# Altium project UZ_D_Encoder.PrjPcb (part 3 of 3)
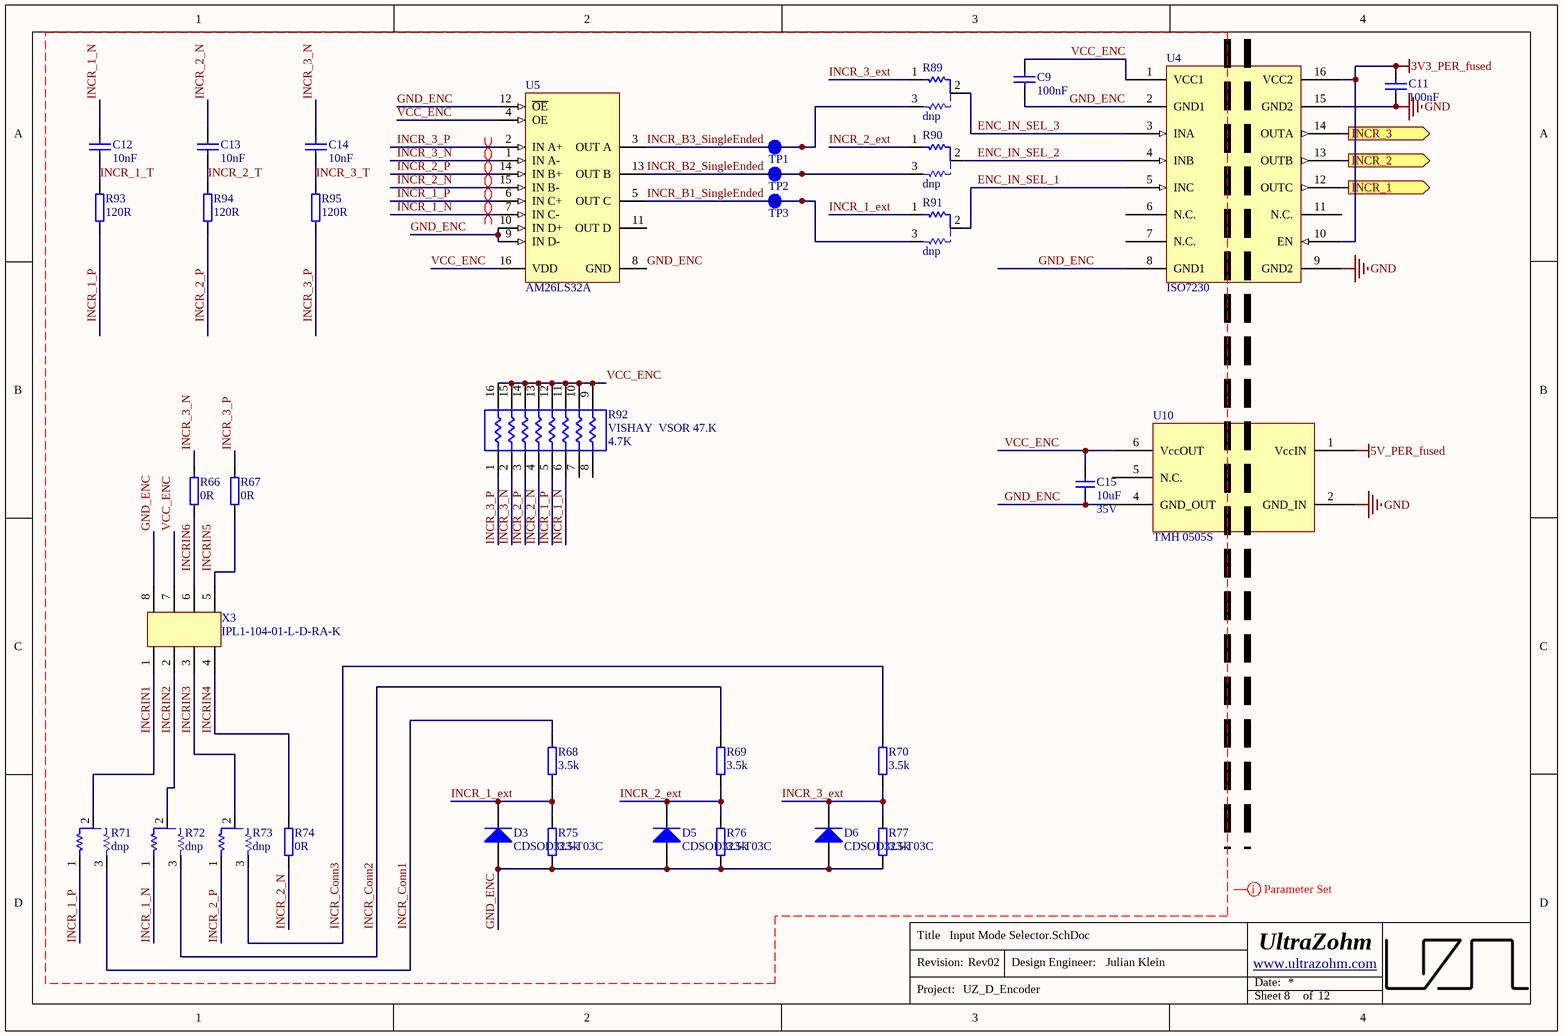
[diagram p16: Input Mode Selector.SchDoc]

## Nets that join several sheets
3V3_PER: Interface connector (F3.1), Goldfinger_Connector (X16.13 X16.14)
3V3_PER_fused: Analog Hall (9 pins), Analog Hall/ADC1 (SW1A.7 SW1A.9 SW1A.11), Analog Hall/ADC2 (SW1B.7 SW1B.9 SW1B.11), Analog Hall/ADC3 (SW1C.7 SW1C.9 SW1C.11), Analog Hall/ADC4 (SW1D.7 SW1D.9 SW1D.11), Analog Hall/GAIN1 (C96A.1 C97A.1 U18A.16), Analog Hall/GAIN2 (C96B.1 C97B.1 U18B.16), Interface connector (9 pins), Goldfinger_Connector (R96.2), Busswitch (R143.1 R144.1 R145.1), Busswitch_B (SW3.7 SW3.9 SW3.11), Busswitch_A (SW2.7 SW2.9 SW2.11), Interface Connector/BS/BusswitchControl (C96C.1 C97C.1 U18C.16), Absolute encoder (BS2A.2), Resolver (10 pins), Incremental Encoder/Incre2 (C11A.2 U4A.10 U4A.16), Incremental Encoder/Incre1 (C11B.2 U4B.10 U4B.16), Absolute encoder2 (BS2B.2)
5V_PER: Interface connector (F2.1), Goldfinger_Connector (X16.9 X16.10)
5V_PER_fused: Interface connector (F2.2 R105.2 X6.5 X6.6), Busswitch_B (C94.1 C95.1 MUX2.17), Busswitch_A (C92.1 C93.1 MUX1.17), Absolute encoder (BS1A.2), Resolver (BS5.2 C116.2 C117.2 U15.6), Incremental Encoder/Incre2 (U10A.1), Incremental Encoder/Incre1 (U10B.1), Absolute encoder2 (BS1B.2)
+5V_Resolver: Resolver (BS5.1 C112.1 C113.1 U15.43), Impedance converter (6 pins)
+12V: Power Supplies (L5.1), Buffer_EXC (13 pins)
+15_DIFF: Analog Hall/ADC1 (C1A.1 C2A.1 LT1A.4 LT1A.5), Analog Hall/ADC2 (C1B.1 C2B.1 LT1B.4 LT1B.5), Analog Hall/ADC3 (C1C.1 C2C.1 LT1C.4 LT1C.5), Analog Hall/ADC4 (C1D.1 C2D.1 LT1D.4 LT1D.5), Power Supplies (C87.2 R118.2 U16.19)
-15V_DIFF: Analog Hall/ADC1 (LT1A.13), Analog Hall/ADC2 (LT1B.13), Analog Hall/ADC3 (LT1C.13), Analog Hall/ADC4 (LT1D.13), Power Supplies (C88.2 R119.2 U16.8)
GND: Analog Hall (16 pins), Analog Hall/ADC1 (25 pins), Analog Hall/ADC2 (25 pins), Analog Hall/ADC3 (25 pins), Analog Hall/ADC4 (25 pins), Power Supplies (34 pins), Analog Hall/GAIN1 (C96A.2 C97A.2 U18A.8), Analog Hall/GAIN2 (C96B.2 C97B.2 U18B.8), Interface connector (14 pins), Goldfinger_Connector (47 pins), Busswitch (R146.2 R147.2 R148.2), Busswitch_B (33 pins), Busswitch_A (9 pins), Interface Connector/BS/BusswitchControl (C96C.2 C97C.2 U18C.8), Absolute encoder (30 pins), Resolver (25 pins), Buffer_EXC (13 pins), Impedance converter (18 pins), Incremental Encoder/Incre2 (C11A.1 U4A.9 U4A.15 U10A.2), Incremental Encoder/Incre1 (C11B.1 U4B.9 U4B.15 U10B.2), Absolute encoder2 (30 pins)
OVCC: Analog Hall (C99.1 U11.19), Analog Hall/ADC1 (5 pins), Analog Hall/ADC2 (5 pins), Analog Hall/ADC3 (5 pins), Analog Hall/ADC4 (5 pins), Power Supplies (C46.1 C47.2 TP17.1 U8.5)
VCC: Analog Hall/ADC1 (C25A.1 C26A.2 U6A.4), Analog Hall/ADC2 (C25B.1 C26B.2 U6B.4), Analog Hall/ADC3 (C25C.1 C26C.2 U6C.4), Analog Hall/ADC4 (C25D.1 C26D.2 U6D.4), Power Supplies (8 pins)
VIN: Interface connector (F1.1), Goldfinger_Connector (X16.5 X16.6)
VIN_fused: Power Supplies (L1.1 L4.1), Interface connector (F1.2 R104.2 X6.1 X6.2), Buffer_EXC (C68.1 U13.1)
VREF: Analog Hall/ADC1 (C29A.1 C30A.2 U6A.3), Analog Hall/ADC2 (C29B.1 C30B.2 U6B.3), Analog Hall/ADC3 (C29C.1 C30C.2 U6C.3), Analog Hall/ADC4 (C29D.1 C30D.2 U6D.3), Power Supplies (C50.1 C51.2 TP18.1 U9.6)
~{RD}: Interface connector (R149.2), Resolver (R128.1 R129.2 U15.3)
~{Reset_Resolver}: Interface connector (X8.14), Goldfinger_Connector (X16.42), Resolver (R130.1 U15.33)
~{Resolver_CS}: Interface connector (R116.2), Resolver (R127.1 U15.2)
A: Interface connector (R110.2), Resolver (R167.2 U15.29)
A0: Analog Hall (R23.1 R40.2), Analog Hall/GAIN1 (U18A.1)
A0: Analog Hall (R32.2 R86.1), Analog Hall/GAIN2 (U18B.1)
A0: Busswitch (R143.2 R146.1), Interface Connector/BS/BusswitchControl (U18C.1)
A1: Analog Hall (R29.1 R42.2), Analog Hall/GAIN1 (U18A.2)
A1: Analog Hall (R33.2 R87.1), Analog Hall/GAIN2 (U18B.2)
A1: Busswitch (R144.2 R147.1), Interface Connector/BS/BusswitchControl (U18C.2)
A2: Analog Hall (R30.1 R43.2), Analog Hall/GAIN1 (U18A.3)
A2: Analog Hall (R39.2 R88.1), Analog Hall/GAIN2 (U18B.3)
A2: Busswitch (R145.2 R148.1), Interface Connector/BS/BusswitchControl (U18C.3)
ADC1_IN_N1: Analog Hall (X17.2), Analog Hall/ADC1 (R9A.1)
ADC1_IN_N2: Analog Hall (X17.6), Analog Hall/ADC2 (R9B.1)
ADC1_IN_N3: Analog Hall (X17.5), Analog Hall/ADC3 (R9C.1)
ADC1_IN_N4: Analog Hall (X2.2 X17.8), Analog Hall/ADC4 (R9D.1)
ADC1_IN_P1: Analog Hall (X17.1), Analog Hall/ADC1 (R6A.1)
ADC1_IN_P2: Analog Hall (X17.3), Analog Hall/ADC2 (R6B.1)
ADC1_IN_P3: Analog Hall (X17.4), Analog Hall/ADC3 (R6C.1)
ADC1_IN_P4: Analog Hall (X2.1 X17.7), Analog Hall/ADC4 (R6D.1)
ADC_CLK: Analog Hall (U11.6), Busswitch_B (MUX2.42), Busswitch_A (MUX1.42)
ADC_CLK_OVCCP: Analog Hall (U11.15), Analog Hall/ADC1 (U6A.16), Analog Hall/ADC2 (U6B.16), Analog Hall/ADC3 (U6C.16), Analog Hall/ADC4 (U6D.16)
ADC_CVN: Analog Hall (U11.14), Analog Hall/ADC1 (U6A.9), Analog Hall/ADC2 (U6B.9), Analog Hall/ADC3 (U6C.9), Analog Hall/ADC4 (U6D.9)
ADC_CVN: Analog Hall (U11.7), Busswitch_B (MUX2.44), Busswitch_A (MUX1.44)
ADC_OUT_OVCCP1: Analog Hall (U11.20), Analog Hall/ADC1 (U6A.14)
ADC_OUT_OVCCP2: Analog Hall (U11.18), Analog Hall/ADC2 (U6B.14)
ADC_OUT_OVCCP3: Analog Hall (U11.17), Analog Hall/ADC3 (U6C.14)
ADC_OUT_OVCCP4: Analog Hall (U11.16), Analog Hall/ADC4 (U6D.14)
ADC_OUT_P1: Analog Hall (U11.1), Busswitch_B (MUX2.53), Busswitch_A (MUX1.53)
ADC_OUT_P2: Analog Hall (U11.3), Busswitch_B (MUX2.51), Busswitch_A (MUX1.51)
ADC_OUT_P3: Analog Hall (U11.4), Busswitch_B (MUX2.46), Busswitch_A (MUX1.48)
ADC_OUT_P4: Analog Hall (U11.5), Busswitch_B (MUX2.48), Busswitch_A (MUX1.46)
B: Interface connector (R111.2), Resolver (R168.2 U15.30)
COS: Resolver (TP7.1 U15.45), Impedance converter (C79.1 R83.2)
COS_LO: Resolver (TP8.1 U15.44), Impedance converter (C82.1 R85.2)
COS_LO_ST: Resolver (X5.4), Impedance converter (C81.1 R84.1)
COS_ST: Resolver (X5.3), Impedance converter (C78.1 R82.1)
DB0: Busswitch_A (MUX1.54), Resolver (U15.28)
DB1: Busswitch_A (MUX1.52), Resolver (U15.27)
DB2: Busswitch_A (MUX1.50), Resolver (U15.26)
DB3: Busswitch_A (MUX1.47), Resolver (U15.25)
DB4: Busswitch_A (MUX1.45), Resolver (U15.24)
DB5: Busswitch_A (MUX1.43), Resolver (U15.23)
DB6: Interface connector (X9.8), Goldfinger_Connector (X16.62), Resolver (U15.22)
DB7: Busswitch_A (MUX1.41), Resolver (U15.21)
DB8: Busswitch_A (MUX1.39), Resolver (U15.20)
DB9: Busswitch_A (MUX1.36), Resolver (U15.17)
DB10: Busswitch_A (MUX1.34), Resolver (U15.16)
DB11: Busswitch_A (MUX1.32), Resolver (U15.15)
DB12: Busswitch_A (MUX1.30), Resolver (U15.14)
DIG_IO_0: Interface connector (X8.1), Goldfinger_Connector (X16.17), Busswitch_A (MUX1.2)
DIG_IO_1: Interface connector (X8.2), Goldfinger_Connector (X16.18), Busswitch_A (MUX1.4)
DIG_IO_2: Interface connector (X8.3), Goldfinger_Connector (X16.21), Busswitch_A (MUX1.6)
DIG_IO_3: Interface connector (X8.4), Goldfinger_Connector (X16.22), Busswitch_A (MUX1.9)
DIG_IO_4: Interface connector (X8.5), Goldfinger_Connector (X16.25), Busswitch_A (MUX1.11)
DIG_IO_5: Interface connector (X8.6), Goldfinger_Connector (X16.26), Busswitch_A (MUX1.13)
DIG_IO_6: Interface connector (R110.1 R149.1 X8.7), Goldfinger_Connector (X16.29)
DIG_IO_7: Interface connector (R111.1 R114.1 X8.8), Goldfinger_Connector (X16.30)
DIG_IO_8: Interface connector (R109.1 R112.1 X8.9), Goldfinger_Connector (X16.33)
DIG_IO_9: Interface connector (R108.1 R113.1 X8.10), Goldfinger_Connector (X16.34)
DIG_IO_10: Interface connector (R116.1 X8.11), Goldfinger_Connector (X16.37)
DIG_IO_11: Interface connector (X8.12), Goldfinger_Connector (X16.38), Resolver (U15.4)
DIG_IO_12: Interface connector (X8.13), Goldfinger_Connector (X16.41), Resolver (R133.1 U15.10)
DIG_IO_14: Interface connector (X8.15), Goldfinger_Connector (X16.45), Resolver (R162.1 R164.2 TP22.1 U15.36)
DIG_IO_15: Interface connector (X8.16), Goldfinger_Connector (X16.46), Resolver (R161.1 R163.2 TP21.1 U15.37)
DIG_IO_16: Interface connector (X9.1), Goldfinger_Connector (X16.49), Busswitch_B (MUX2.2)
DIG_IO_17: Interface connector (X9.2), Goldfinger_Connector (X16.50), Busswitch_B (MUX2.4)
DIG_IO_18: Interface connector (X9.3), Goldfinger_Connector (X16.53), Busswitch_B (MUX2.6)
DIG_IO_19: Interface connector (X9.4), Goldfinger_Connector (X16.54), Busswitch_B (MUX2.9)
DIG_IO_20: Interface connector (X9.5), Goldfinger_Connector (X16.57), Busswitch_B (MUX2.11)
DIG_IO_21: Interface connector (X9.6), Goldfinger_Connector (X16.58), Busswitch_B (MUX2.13)
DIG_IO_22: Interface connector (R97.2 R98.1 X9.7), Goldfinger_Connector (X16.61)
DIG_IO_24: Interface connector (X9.9), Goldfinger_Connector (X16.65), Busswitch_A (MUX1.15)
DIG_IO_25: Interface connector (X9.10), Goldfinger_Connector (X16.66), Busswitch_A (MUX1.18)
DIG_IO_26: Interface connector (X9.11), Goldfinger_Connector (X16.69), Busswitch_A (MUX1.21)
DIG_IO_27: Interface connector (X9.12), Goldfinger_Connector (X16.70), Busswitch_A (MUX1.23)
DIG_IO_28: Interface connector (X9.13), Goldfinger_Connector (X16.73), Busswitch_A (MUX1.25)
DIG_IO_29: Interface connector (X9.14), Goldfinger_Connector (X16.74), Busswitch_A (MUX1.27)
DIR: Interface connector (R108.2), Resolver (R170.2 U15.32)
DOS: Analog Hall/GAIN1 (U18A.7), Interface connector (U12.2), Resolver (R126.2 U15.35)
EXC: Resolver (TP11.1 U15.38), Buffer_EXC (R61.2)
INCR_A1: Busswitch_B (MUX2.54), Incremental Encoder/Incre1 (U4B.12)
INCR_A2: Busswitch_B (MUX2.52), Incremental Encoder/Incre1 (U4B.13)
INCR_A3: Busswitch_B (MUX2.50), Incremental Encoder/Incre1 (U4B.14)
INCR_B1: Busswitch_B (MUX2.47), Incremental Encoder/Incre2 (U4A.12)
INCR_B2: Busswitch_B (MUX2.45), Incremental Encoder/Incre2 (U4A.13)
INCR_B3: Busswitch_B (MUX2.43), Incremental Encoder/Incre2 (U4A.14)
LOT: Analog Hall/GAIN1 (U18A.9), Interface connector (U12.1), Resolver (R125.2 U15.34)
N_EXC: Resolver (TP12.1 U15.39), Buffer_EXC (R48.2)
NetMUX1_3: Busswitch_A (MUX1.3), Absolute encoder2 (U2B.7)
NetMUX1_5: Busswitch_A (MUX1.5), Absolute encoder2 (U2B.5)
NetMUX1_7: Busswitch_A (MUX1.7), Absolute encoder2 (U2B.6)
NetMUX1_10: Busswitch_A (MUX1.10), Absolute encoder2 (U2B.4)
NetMUX1_12: Busswitch_A (MUX1.12), Absolute encoder2 (U2B.8)
NetMUX1_14: Busswitch_A (MUX1.14), Absolute encoder2 (U2B.9)
NM: Interface connector (R109.2), Resolver (R169.2 U15.31)
P0: Analog Hall/ADC1 (R19A.1), Analog Hall/GAIN1 (U18A.4)
P0: Analog Hall/ADC3 (R19C.1), Analog Hall/GAIN2 (U18B.4)
P0: Busswitch_A (R124.1), Interface Connector/BS/BusswitchControl (U18C.4)
P1: Analog Hall/ADC1 (R20A.1), Analog Hall/GAIN1 (U18A.5)
P1: Analog Hall/ADC3 (R20C.1), Analog Hall/GAIN2 (U18B.5)
P1: Busswitch_A (R123.1), Interface Connector/BS/BusswitchControl (U18C.5)
P2: Analog Hall/ADC1 (R22A.1), Analog Hall/GAIN1 (U18A.6)
P2: Analog Hall/ADC3 (R22C.1), Analog Hall/GAIN2 (U18B.6)
P2: Busswitch_A (R122.1), Interface Connector/BS/BusswitchControl (U18C.6)
P5: Analog Hall/ADC2 (R19B.1), Analog Hall/GAIN1 (U18A.10)
P5: Analog Hall/ADC4 (R19D.1), Analog Hall/GAIN2 (U18B.10)
P5: Busswitch_B (R140.1), Interface Connector/BS/BusswitchControl (U18C.10)
P6: Analog Hall/ADC2 (R20B.1), Analog Hall/GAIN1 (U18A.11)
P6: Analog Hall/ADC4 (R20D.1), Analog Hall/GAIN2 (U18B.11)
P6: Busswitch_B (R141.1), Interface Connector/BS/BusswitchControl (U18C.11)
P7: Analog Hall/ADC2 (R22B.1), Analog Hall/GAIN1 (U18A.12)
P7: Analog Hall/ADC4 (R22D.1), Analog Hall/GAIN2 (U18B.12)
P7: Busswitch_B (R142.1), Interface Connector/BS/BusswitchControl (U18C.12)
READ_WRITE_CLOCK_SH: Busswitch_B (MUX2.14), Busswitch_A (MUX1.28 MUX1.29), Absolute encoder (U2A.9)
READ_WRITE_DATA_SH: Busswitch_B (MUX2.7), Busswitch_A (MUX1.22 MUX1.35), Absolute encoder (U2A.6)
Resolver_SCLK: Interface connector (R114.2), Resolver (U15.13)
Resolver_SDI: Interface connector (R112.2), Resolver (U15.12)
Resolver_SDO: Interface connector (R113.2), Resolver (U15.11)
RX-S_CLOCK_SH: Busswitch_B (MUX2.10), Busswitch_A (MUX1.24 MUX1.33), Absolute encoder (U2A.7)
RX-S_DATA_SH: Busswitch_B (MUX2.3), Busswitch_A (MUX1.16 MUX1.40), Absolute encoder (U2A.4)
SCL: Analog Hall/GAIN1 (U18A.14), Analog Hall/GAIN2 (U18B.14), Interface connector (R107.1 X9.15), Goldfinger_Connector (X16.89), Interface Connector/BS/BusswitchControl (U18C.14)
SDA: Analog Hall/GAIN1 (U18A.15), Analog Hall/GAIN2 (U18B.15), Interface connector (R103.2 X9.16), Goldfinger_Connector (X16.90), Interface Connector/BS/BusswitchControl (U18C.15)
SIN: Resolver (TP9.1 U15.41), Impedance converter (C76.1 R81.2)
SIN_LO: Resolver (TP10.1 U15.42), Impedance converter (C73.1 R79.2)
SIN_LO_ST: Resolver (X5.1), Impedance converter (C72.1 R78.1)
SIN_ST: Resolver (X5.2), Impedance converter (C75.1 R80.1)
TX-S_CLOCK_SH: Busswitch_B (MUX2.12), Busswitch_A (MUX1.26 MUX1.31), Absolute encoder (U2A.8)
TX-S_DATA_SH: Busswitch_B (MUX2.5), Busswitch_A (MUX1.20 MUX1.37), Absolute encoder (U2A.5)
Vout_EXC: Resolver (X5.6), Buffer_EXC (C70.2 R53.2 R62.2 R63.1)
Vout_N_EXC: Resolver (X5.5), Buffer_EXC (C66.2 R36.2 R49.2 R50.1)

## Assembly variants
Default: not fitted C53 C54 C55 C60 C61 C62 R1 R2 R3 R4 R5 R6 R7 R98 R99 R100 R101 R102 R103 R107 R108 R109 R129 R131 R154 R155 R156 R157 R158 R159 R160 R161 R162 R173 R174